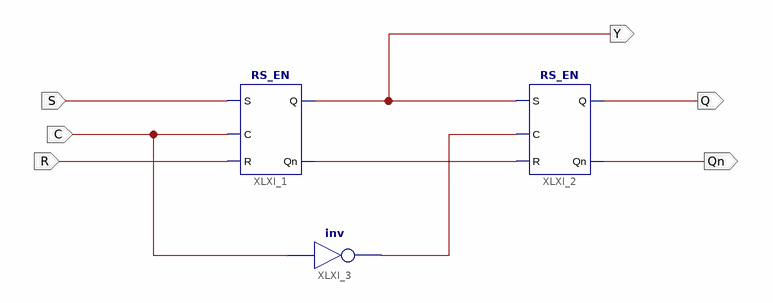
[diagram p0: schematic sheet 1]
// Xilinx ISE schematic RS_Trig.sch (kintex7) as structural Verilog: 3 symbols, 6 ports
module RS_Trig (
  input  C,
  input  S,
  input  R,
  output Y,
  output Q,
  output Qn
);

  wire XLXN_3, XLXN_7;

  RS_EN XLXI_1 (.C(C), .S(S), .R(R), .Q(Y), .Qn(XLXN_7));
  RS_EN XLXI_2 (.C(XLXN_3), .S(Y), .R(XLXN_7), .Q(Q), .Qn(Qn));
  not XLXI_3 (XLXN_3, C);
endmodule
